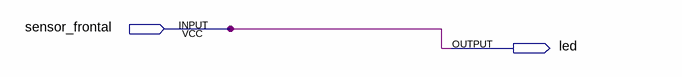
[diagram p0: schematic sheet]
// Quartus schematic pruebaled.bdf as structural Verilog: 0 symbols, 2 pins
module pruebaled (
  input  sensor_frontal,
  output led
);


  assign led = sensor_frontal;
endmodule
